# Altium schematic sheet Encoder.SchDoc
size A4; SheetNumber: 6; SheetTotal: 6
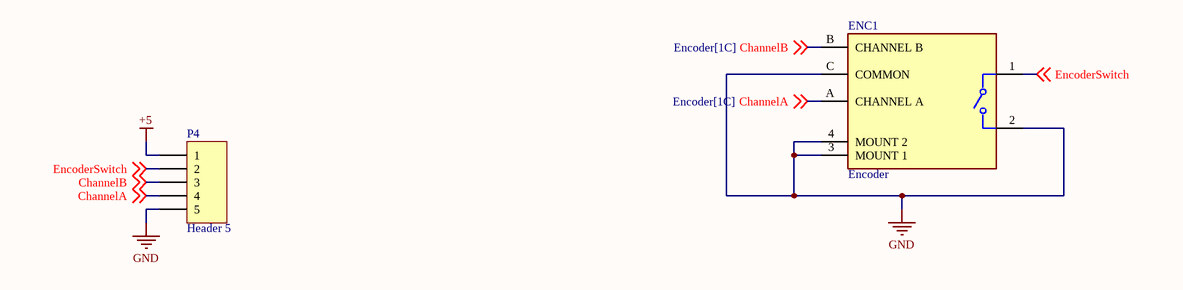
[diagram p0: Encoder.SchDoc]

## Parts
ENC1  Encoder  [FP-PEC12R-4117F-S0012-0]
P4  Header 5  [HDR1X5]

## Nets
+5: P4.1
GND: ENC1.2 ENC1.3(MOUNT_1) ENC1.4(MOUNT_2) ENC1.C(COMMON) P4.5
ChannelA: ENC1.A(CHANNEL_A) P4.4 ; off-sheet ChannelA
ChannelB: ENC1.B(CHANNEL_B) P4.3 ; off-sheet ChannelB
EncoderSwitch: ENC1.1 P4.2 ; off-sheet EncoderSwitch

## Library data of the parts
ENC1 = Encoder: Built in Switch: Yes; Encoder Type: Mechanical; Pulses per Revolution: 24; Output Type: Quadrature; Hole Diameter: 2mm; Number of Channels: 2; Max Supply Voltage (DC): 5V; RoHS Compliant: Yes; Max Operating Temperature: 70°C; Length: 26mm; Width: 12.5mm; Series: PEC12R; Mount: Through Hole; Height: 13.4mm; Packaging: Bulk; Package Quantity: 150; Termination: PC Pin; Min Operating Temperature: -30°C; REACH SVHC: No SVHC; Detent: Yes; Orientation: Vertical
P4 = Header 5: Header, 5-Pin; LatestRevisionDate: 17-Jul-2002; LatestRevisionNote: Re-released for DXP Platform.; Publisher: Altium Limited